# EAGLE design RainbowCycle (EAGLE 6.5.0)
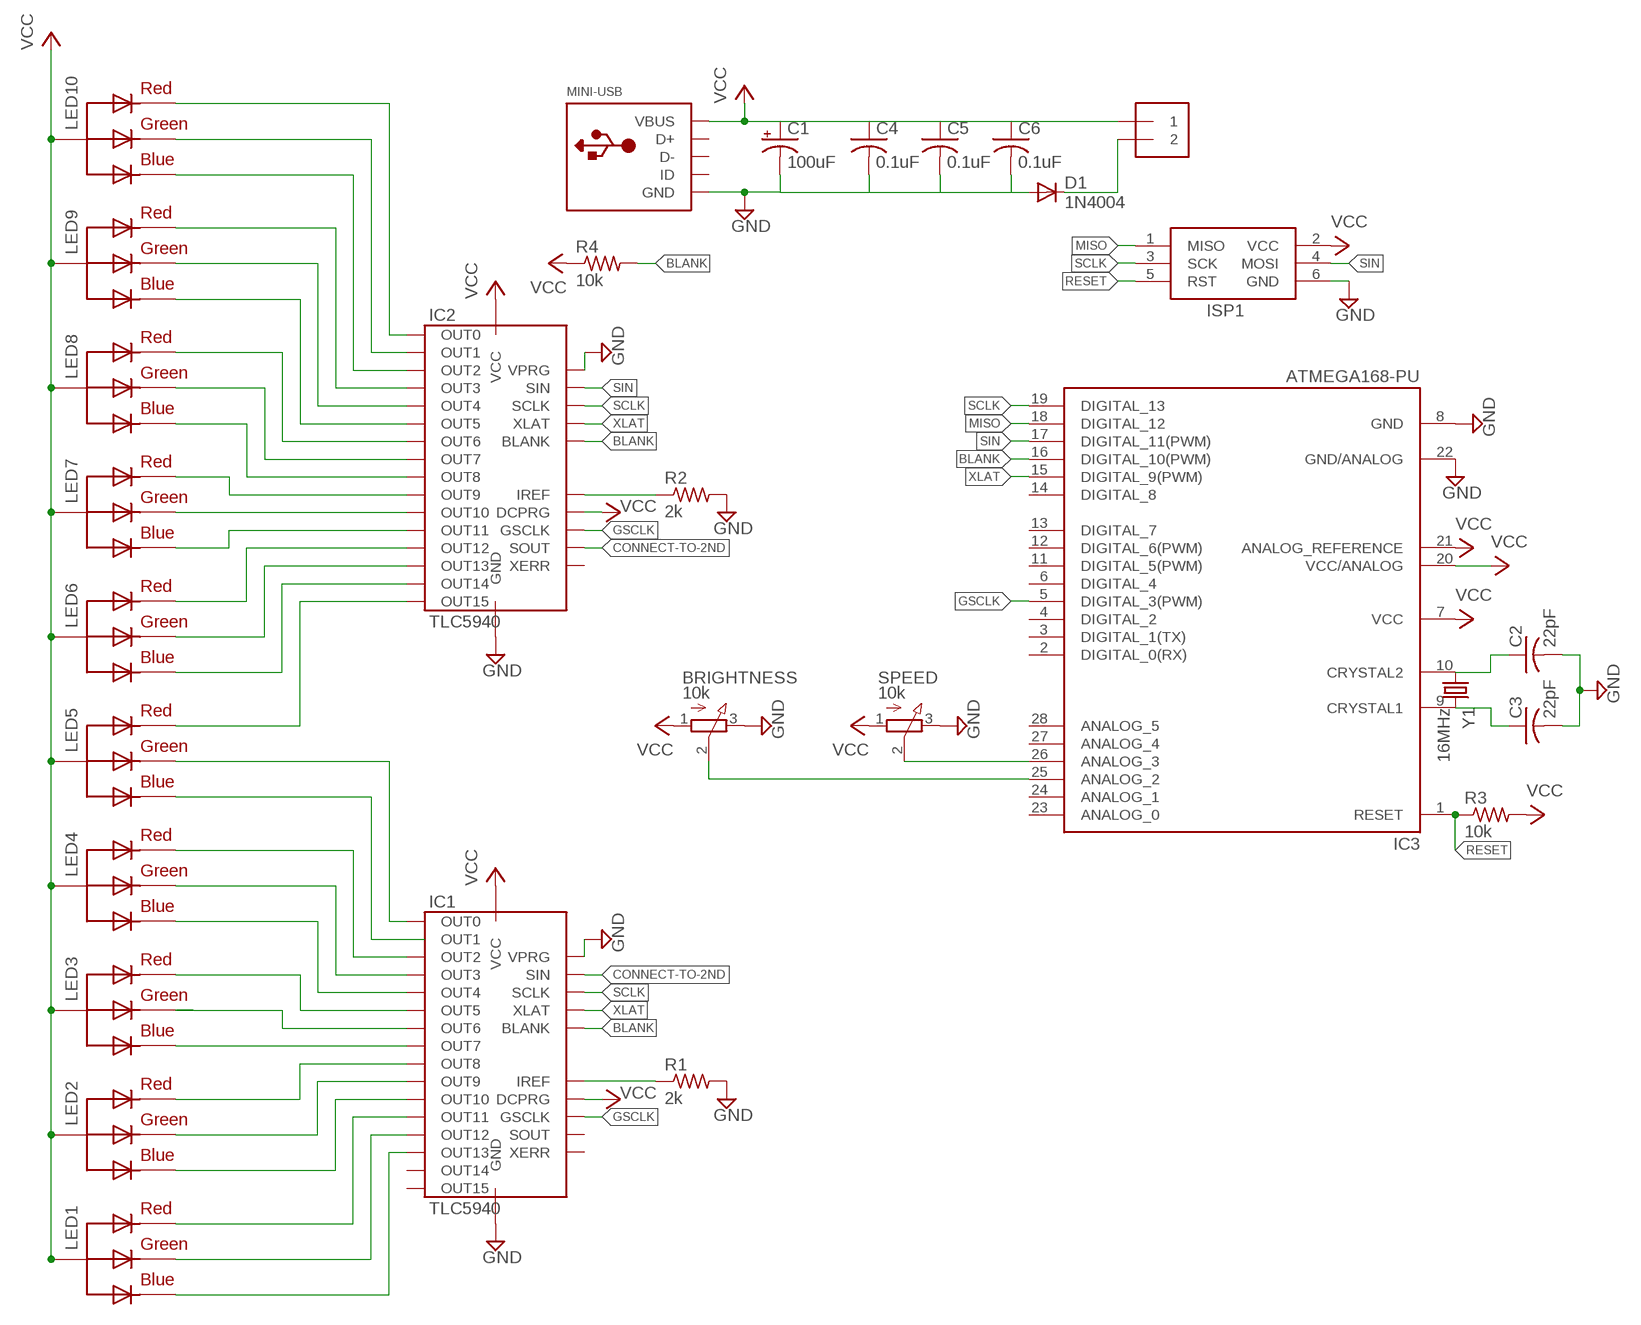
[diagram p0: schematic, sheet 1]

## Parts
BLOCK-TERMINAL  1X2-5.08MM  [1X2-5.08MM]
BRIGHTNESS  10k  3RP/1610N  [3RP/1610N]
C1  100uF  CPOL-USE2.5-6  [E2,5-6]
C2  22pF  C-US050-025X075  [C050-025X075]
C3  22pF  C-US050-025X075  [C050-025X075]
C4  0.1uF  C-US050-025X075  [C050-025X075]
C5  0.1uF  C-US050-025X075  [C050-025X075]
C6  0.1uF  C-US050-025X075  [C050-025X075]
D1  1N4004  [DO41-10]
IC1  TLC5940  IC-PACKAGE_DIL28-3  [IC-PACKAGE_DIL28-3]
IC2  TLC5940  IC-PACKAGE_DIL28-3  [IC-PACKAGE_DIL28-3]
IC3  ATMEGA168-PU  [DIL28-3]
ISP1  AVRISP-6  [AVRISP]
LED1  RGBLED_CA  RGBLED_CA-PIRANHA  [PIRANHA5MM]
LED2  RGBLED_CA  RGBLED_CA-PIRANHA  [PIRANHA5MM]
LED3  RGBLED_CA  RGBLED_CA-PIRANHA  [PIRANHA5MM]
LED4  RGBLED_CA  RGBLED_CA-PIRANHA  [PIRANHA5MM]
LED5  RGBLED_CA  RGBLED_CA-PIRANHA  [PIRANHA5MM]
LED6  RGBLED_CA  RGBLED_CA-PIRANHA  [PIRANHA5MM]
LED7  RGBLED_CA  RGBLED_CA-PIRANHA  [PIRANHA5MM]
LED8  RGBLED_CA  RGBLED_CA-PIRANHA  [PIRANHA5MM]
LED9  RGBLED_CA  RGBLED_CA-PIRANHA  [PIRANHA5MM]
LED10  RGBLED_CA  RGBLED_CA-PIRANHA  [PIRANHA5MM]
MINI-USB  USBMOLEX  [USB-MINIB-THM-MOLEX]
R1  2k  R-US_0207/10  [0207/10]
R2  2k  R-US_0207/10  [0207/10]
R3  10k  R-US_0207/10  [0207/10]
R4  10k  R-US_0207/10  [0207/10]
SPEED  10k  3RP/1610N  [3RP/1610N]
Y1  16MHz  CRYSTALHC49US  [HC49US]

## Nets
BLANK: IC1.23(BLANK) IC2.23(BLANK) IC3.16(DIGITAL_10(PWM)) R4.2
CONNECT-TO-2ND: IC1.26(SIN) IC2.17(SOUT)
GND [gnd]: BRIGHTNESS.3(E) C1.- C2.2 C3.2 C4.2 C5.2 C6.2 D1.A IC1.22(GND) IC1.27(VPRG) IC2.22(GND) IC2.27(VPRG) IC3.8(GND) IC3.22(GND/ANALOG) ISP1.6(GND) MINI-USB.GND MINI-USB.GND1(GND) MINI-USB.GND4(GND) R1.2 R2.2 SPEED.3(E)
GSCLK: IC1.18(GSCLK) IC2.18(GSCLK) IC3.5(DIGITAL_3(PWM))
MISO: IC3.18(DIGITAL_12) ISP1.1(MISO)
N$1: BRIGHTNESS.2(S) IC3.25(ANALOG_2)
N$2: IC3.26(ANALOG_3) SPEED.2(S)
N$6: IC2.20(IREF) R2.1
N$12: BLOCK-TERMINAL.2 D1.C
N$16: C3.1 IC3.9(CRYSTAL1) Y1.2
N$21: C2.1 IC3.10(CRYSTAL2) Y1.1
N$22: IC2.28(OUT0) LED10.3(RED)
N$23: IC1.1(OUT1) LED5.1(BLUE)
N$24: IC2.1(OUT1) LED10.2(GREEN)
N$25: IC2.2(OUT2) LED10.1(BLUE)
N$26: IC1.20(IREF) R1.1
N$27: IC2.3(OUT3) LED9.3(RED)
N$28: IC2.4(OUT4) LED9.2(GREEN)
N$29: IC2.5(OUT5) LED9.1(BLUE)
N$30: IC2.6(OUT6) LED8.3(RED)
N$33: IC2.7(OUT7) LED8.2(GREEN)
N$34: IC2.8(OUT8) LED8.1(BLUE)
N$35: IC2.9(OUT9) LED7.3(RED)
N$36: IC2.10(OUT10) LED7.2(GREEN)
N$37: IC2.11(OUT11) LED7.1(BLUE)
N$38: IC2.12(OUT12) LED6.3(RED)
N$39: IC2.13(OUT13) LED6.2(GREEN)
N$40: IC2.14(OUT14) LED6.1(BLUE)
N$41: IC2.15(OUT15) LED5.3(RED)
N$42: IC1.28(OUT0) LED5.2(GREEN)
N$43: IC1.13(OUT13) LED1.1(BLUE)
N$44: IC1.2(OUT2) LED4.3(RED)
N$45: IC1.3(OUT3) LED4.2(GREEN)
N$46: IC1.4(OUT4) LED4.1(BLUE)
N$47: IC1.5(OUT5) LED3.3(RED)
N$48: IC1.6(OUT6) LED3.2(GREEN)
N$49: IC1.7(OUT7) LED3.1(BLUE)
N$50: IC1.12(OUT12) LED1.2(GREEN)
N$51: IC1.11(OUT11) LED1.3(RED)
N$52: IC1.10(OUT10) LED2.1(BLUE)
N$53: IC1.9(OUT9) LED2.2(GREEN)
N$54: IC1.8(OUT8) LED2.3(RED)
RESET: IC3.1(RESET) ISP1.5(RST) R3.1
SCLK: IC1.25(SCLK) IC2.25(SCLK) IC3.19(DIGITAL_13) ISP1.3(SCK)
SIN: IC2.26(SIN) IC3.17(DIGITAL_11(PWM)) ISP1.4(MOSI)
VCC [power]: BLOCK-TERMINAL.1 BRIGHTNESS.1(A) C1.+ C4.1 C5.1 C6.1 IC1.19(DCPRG) IC1.21(VCC) IC2.19(DCPRG) IC2.21(VCC) IC3.7(VCC) IC3.20(VCC/ANALOG) IC3.21(ANALOG_REFERENCE) ISP1.2(VCC) LED1.4(VCC) LED2.4(VCC) LED3.4(VCC) LED4.4(VCC) LED5.4(VCC) LED6.4(VCC) LED7.4(VCC) LED8.4(VCC) LED9.4(VCC) LED10.4(VCC) MINI-USB.VBUS R3.2 R4.1 SPEED.1(A)
XLAT: IC1.24(XLAT) IC2.24(XLAT) IC3.15(DIGITAL_9(PWM))
Unconnected: IC1.14(OUT14) IC1.15(OUT15) IC1.16(XERR) IC1.17(SOUT) IC2.16(XERR) IC3.2(DIGITAL_0(RX)) IC3.3(DIGITAL_1(TX)) IC3.4(DIGITAL_2) IC3.6(DIGITAL_4) IC3.11(DIGITAL_5(PWM)) IC3.12(DIGITAL_6(PWM)) IC3.13(DIGITAL_7) IC3.14(DIGITAL_8) IC3.23(ANALOG_0) IC3.24(ANALOG_1) IC3.27(ANALOG_4) IC3.28(ANALOG_5) MINI-USB.D+ MINI-USB.D- MINI-USB.ID

## Library data of the parts
BLOCK-TERMINAL = adafruit:1X2: 3.5mm Terminal block http://www.ladyada.net/library/pcb/eaglelibrary.html
BRIGHTNESS SPEED = pot:3RP/1610N: 16mm Potentiometer one level Source: http://www.alphapotentiometers.net/html/16mm_pot_2.html
C1 = rcl:CPOL-US: POLARIZED CAPACITOR, American symbol
C2-C6 = adafruit:C-US: CAPACITOR, American symbol
D1 = adafruit:1N4004: DIODE General purpose 1N400x type rectifier (With bigger pads) http://www.ladyada.net/library/pcb/eaglelibrary.html
IC1 IC2 = TLC5940:IC-PACKAGE_DIL28: Dual In Line
IC3 = Arduino-AVR:ATMEGA168-PU
ISP1 = adafruit:AVRISP: AVR ISP HEADER Standard 6 pin header for AVR programming
LED1-LED10 = adafruit:RGBLED_CA: RGB LED, common-anode 5MM Staggered pins 5mm Piranha package http://www.ladyada.net/library/pcb/eaglelibrary.html
MINI-USB = adafruit:USB: USB Connectors USBMINIB - Surface Mount Female Mini-B USB Connector 4UConnector: 06564 By microbuilder.eu Thru-hole RA Female Mini-B USB Connector 4UConnector: 18732 By ladyada.net
R1-R4 = rcl:R-US_: RESISTOR, American symbol
Y1 = SparkFun-FreqCtrl:CRYSTAL: Various standard crystals. Proven footprints. Spark Fun Electronics SKU : COM-00534

## Net classes
0 default: width 0.254 mm, drill 0.508 mm, clearance 0.305 mm
1 power: width 0.61 mm, drill 0.61 mm, clearance 0.305 mm
2 gnd: width 0.305 mm, drill 0.559 mm, clearance 0.305 mm

## Board
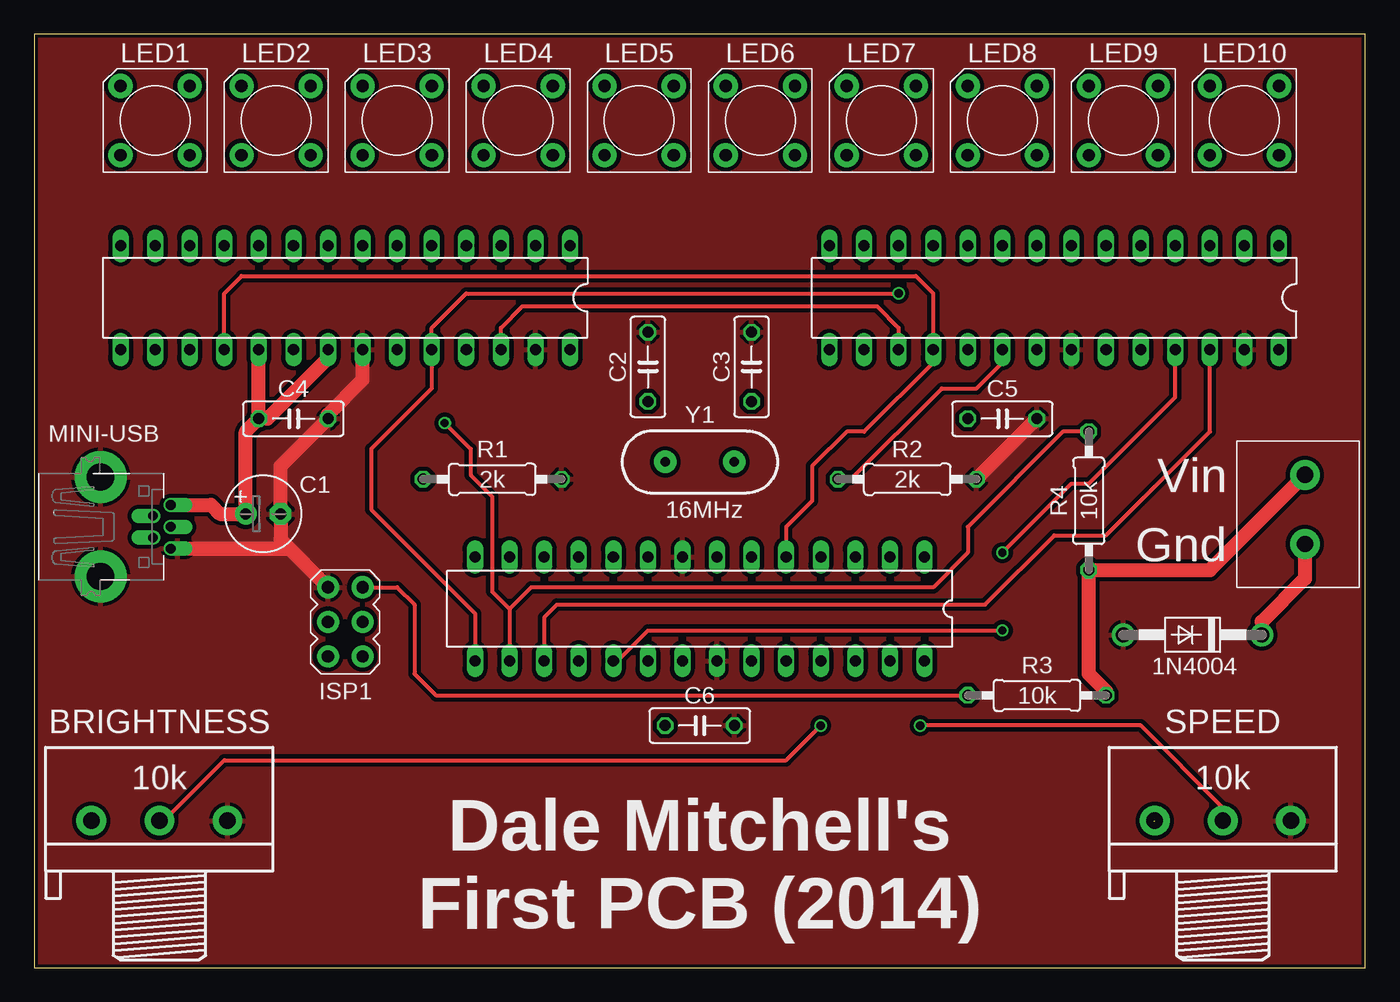
[diagram p1: board, top side]
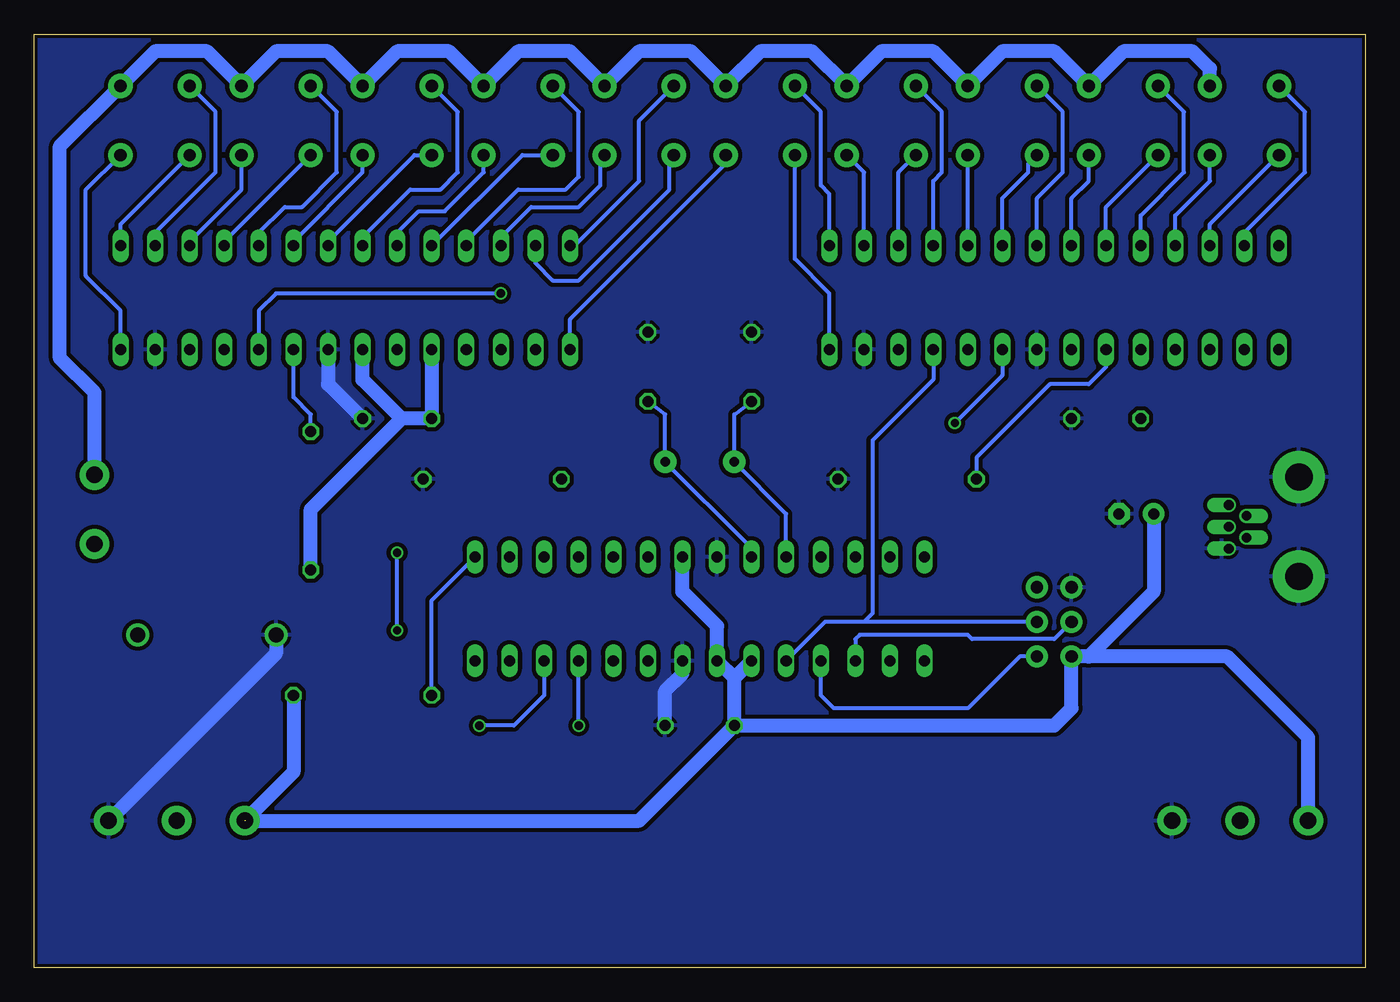
[diagram p2: board, bottom side, seen from below]

Size 97.79 x 68.58 mm. Coordinates in mm from the lower left corner, seen from the top.
Outline: 0,68.58 0,0 97.79,0 97.79,68.58 0,68.58
Copper layers (1*2*15*16): Top 0.035mm / dielectric 0.2mm / Route2 0.0175mm / dielectric 1.1mm / Route15 0.0175mm / dielectric 0.2mm / Bottom 0.035mm
Design rules "SeeedStudio_DRU_no_angle_20130527": minimum track width 6mil, minimum drill 12mil, track to track 6mil, track to pad 6mil, pad to pad 6mil, via to via 6mil, smd to smd 0mil, copper to edge 10mil, drill to drill 10mil, minimum pad ring 6mil, minimum via ring 6mil, stop-mask expansion 2mil, vias tented up to drill 25mil, thermal gap 10mil

### Footprints (pad centres in the part's own frame; a part is rotated, then mirrored left to right if it is on the bottom)
1X2-5.08MM = drill 1.2 pad 2.184: 1 2.54,0; 2 -2.54,0
3RP/1610N = drill 1.2 pad 2.184: 1 -5,0; 2 0,0; 3 5,0
E2,5-6 = drill 0.813 pad 1.6: + -1.27,0 | drill 0.813 pad 1.6 octagon: - 1.27,0
C050-025X075 = drill 0.813 octagon: 1 -2.54,0; 2 2.54,0
DO41-10 = drill 1.118: A 5.08,0; C -5.08,0
IC-PACKAGE_DIL28-3 = drill 0.813 long: 1 -16.51,-3.81; 2 -13.97,-3.81; 3 -11.43,-3.81; 4 -8.89,-3.81; 5 -6.35,-3.81; 6 -3.81,-3.81; 7 -1.27,-3.81; 8 1.27,-3.81; 9 3.81,-3.81; 10 6.35,-3.81; 11 8.89,-3.81; 12 11.43,-3.81; 13 13.97,-3.81; 14 16.51,-3.81; 15 16.51,3.81; 16 13.97,3.81; 17 11.43,3.81; 18 8.89,3.81; 19 6.35,3.81; 20 3.81,3.81; 21 1.27,3.81; 22 -1.27,3.81; 23 -3.81,3.81; 24 -6.35,3.81; 25 -8.89,3.81; 26 -11.43,3.81; 27 -13.97,3.81; 28 -16.51,3.81
DIL28-3 = drill 0.813 long: 1 -16.51,-3.81; 2 -13.97,-3.81; 3 -11.43,-3.81; 4 -8.89,-3.81; 5 -6.35,-3.81; 6 -3.81,-3.81; 7 -1.27,-3.81; 8 1.27,-3.81; 9 3.81,-3.81; 10 6.35,-3.81; 11 8.89,-3.81; 12 11.43,-3.81; 13 13.97,-3.81; 14 16.51,-3.81; 15 16.51,3.81; 16 13.97,3.81; 17 11.43,3.81; 18 8.89,3.81; 19 6.35,3.81; 20 3.81,3.81; 21 1.27,3.81; 22 -1.27,3.81; 23 -3.81,3.81; 24 -6.35,3.81; 25 -8.89,3.81; 26 -11.43,3.81; 27 -13.97,3.81; 28 -16.51,3.81
AVRISP = drill 0.9 pad 1.626: 1 -1.27,2.54; 2 1.27,2.54; 3 -1.27,0; 4 1.27,0; 5 -1.27,-2.54; 6 1.27,-2.54
PIRANHA5MM = drill 0.9 pad 1.778: 1 -2.54,2.54; 2 -2.54,-2.54; 3 2.54,-2.54; 4 2.54,2.54
USB-MINIB-THM-MOLEX = drill 0.7 offset: D+ 0,9.72; D- -0.8,8.42; GND 1.6,9.72; ID 0.8,8.42; VBUS -1.6,9.72 | drill 2 pad 3.81: GND1 -3.65,4.57; GND4 3.65,4.57
0207/10 = drill 0.813 octagon: 1 -5.08,0; 2 5.08,0
HC49US = drill 0.7 pad 1.651: 1 -2.54,0; 2 2.54,0

### Placement (x,y rotation side)
BLOCK-TERMINAL  93.34,33.66 90 top
BRIGHTNESS  9.21,10.8 0 top
C1  16.83,33.34 0 top
C2  45.08,44.13 90 top
C3  52.7,44.13 90 top
C4  19.05,40.32 0 top
C5  71.12,40.32 0 top
C6  48.89,17.78 0 top
D1  85.09,24.45 180 top
IC1  22.86,49.21 180 top
IC2  74.93,49.21 180 top
IC3  48.89,26.35 180 top
ISP1  22.86,25.4 180 top
LED1  8.89,62.23 0 top
LED2  17.78,62.23 0 top
LED3  26.67,62.23 0 top
LED4  35.56,62.23 0 top
LED5  44.45,62.23 0 top
LED6  53.34,62.23 0 top
LED7  62.23,62.23 0 top
LED8  71.12,62.23 0 top
LED9  80.01,62.23 0 top
LED10  88.9,62.23 0 top
MINI-USB  0.32,32.38 270 top
R1  33.66,35.88 0 top
R2  64.13,35.88 0 top
R3  73.66,20 0 top
R4  77.47,34.29 90 top
SPEED  87.31,10.8 0 top
Y1  48.89,37.15 0 top

### Tracks (layer width: path | path; a pad name or v marks a point on that pad's centre or on a via)
BLANK  (via drill 0.6)
  Top 0.305: 34.92,26.35 33.66,27.62 33.66,34.61 32.07,36.2 32.07,38.1 v30.16,40.01 | 34.92,26.35 IC3.16 | R4.2 75.56,39.37 68.58,32.38 68.58,30.48 66.04,27.94 36.51,27.94 34.92,26.35
  Bottom 0.305: R4.2 77.47,40.64 78.74,41.91 IC2.23 | IC1.23 26.67,43.5 v30.16,40.01
CONNECT-TO-2ND
  Top 0.305: IC1.26 34.29,46.99 35.88,48.58 61.91,48.58 63.5,46.99 IC2.17
GND
  Top 1.016: IC1.22 24.13,43.18 21.59,40.64 C4.2 18.1,36.83 C1.- 18.1,31.43 ISP1.6 18.75,30.79 MINI-USB.GND | R2.2 C5.2
  Bottom 1.016: D1.A 80.01,23.1 SPEED.3 | C6.2 51.44,20.32 50.16,21.59 IC3.22 | IC2.22 76.2,42.86 C5.2
  pour Top: -1.27,69.85 99.06,69.85 99.06,-1.27 -1.27,-1.27
  pour Bottom: -1.27,69.85 99.06,69.85 99.06,-1.27 -1.27,-1.27
GSCLK
  Top 0.305: IC3.5 55.24,32.38 57.15,34.29 57.15,36.83 59.69,39.37 60.96,39.37 66.04,44.45 IC2.18 66.04,49.53 64.77,50.8 15.24,50.8 13.97,49.53 IC1.18
MISO
  Bottom 0.305: ISP1.1 25.4,22.86 29.21,19.05 39.05,19.05 40,20 IC3.18
N$1  (via drill 0.6)
  Top 0.305: v57.78,17.78 55.24,15.24 13.97,15.24 9.52,10.8 BRIGHTNESS.2
  Bottom 0.305: v57.78,17.78 IC3.25
N$2  (via drill 0.6)
  Top 0.305: SPEED.2 87.31,11.75 81.28,17.78 v65.09,17.78
  Bottom 0.305: IC3.26 60.33,20 62.55,17.78 v65.09,17.78
N$6
  Top 0.305: R2.1 60.01,35.88 66.67,42.55 69.22,42.55 71.12,44.45 IC2.20
N$12
  Top 1.016: BLOCK-TERMINAL.2 93.34,28.57 90.17,25.4 D1.C
N$16
  Bottom 0.305: IC3.9 45.08,31.12 45.4,31.12 Y1.2 51.44,40.64 C3.1
N$21
  Bottom 0.305: C2.1 46.35,40.64 Y1.1 42.55,33.34 IC3.10
N$22
  Bottom 0.305: IC2.28 91.44,48.26 93.98,50.8 93.98,57.15 LED10.3
N$23
  Bottom 0.305: LED5.1 40,62.87 40,57.47 39.37,56.83 IC1.1
N$24
  Bottom 0.305: IC2.1 91.44,54.61 LED10.2
N$25
  Bottom 0.305: IC2.2 88.9,53.98 84.45,58.42 84.45,62.87 LED10.1
N$26
  Bottom 0.305: IC1.20 19.05,44.13 20.32,42.86 23.18,42.86 28.57,37.47 R1.1
N$27
  Bottom 0.305: IC2.3 86.36,53.34 82.55,57.15 LED9.3
N$28
  Bottom 0.305: IC2.4 83.82,53.34 LED9.2
N$29
  Bottom 0.305: IC2.5 81.28,53.98 79.38,55.88 78.1,55.88 75.56,58.42 75.56,62.87 LED9.1
N$30
  Bottom 0.305: IC2.6 78.74,53.34 73.66,58.42 LED8.3
N$33
  Bottom 0.305: IC2.7 76.2,53.34 69.85,59.69 LED8.2
N$34
  Bottom 0.305: IC2.8 73.66,53.66 70.17,57.15 67.94,57.15 66.67,58.42 66.67,62.87 LED8.1
N$35
  Bottom 0.305: IC2.9 71.12,53.98 69.53,55.56 67.63,55.56 64.77,58.42 LED7.3
N$36
  Bottom 0.305: IC2.10 61.91,59.69 LED7.2
N$37
  Bottom 0.305: IC2.11 66.04,53.34 62.23,57.15 58.74,57.15 57.78,58.1 57.78,62.87 LED7.1
N$38
  Bottom 0.305: IC2.12 63.5,53.66 61.28,55.88 57.78,55.88 56.2,57.47 56.2,59.37 LED6.3
N$39
  Bottom 0.305: IC2.13 60.96,51.75 59.69,50.48 57.78,50.48 51.12,57.15 51.12,59.37 LED6.2
N$40
  Bottom 0.305: IC2.14 58.1,53.02 53.34,57.79 53.34,62.23 LED6.1
N$41
  Bottom 0.305: IC2.15 58.42,47.62 46.99,59.05 LED5.3
N$42
  Bottom 0.305: IC1.28 39.37,49.53 41.91,52.07 LED5.2
N$43
  Bottom 0.305: IC1.13 8.89,53.98 4.45,58.42 4.45,62.87 LED1.1
N$44
  Bottom 0.305: IC1.2 36.83,58.42 LED4.3
N$45
  Bottom 0.305: IC1.3 34.29,58.42 LED4.2
N$46
  Bottom 0.305: IC1.4 31.75,57.79 31.11,58.42 31.11,62.87 LED4.1
N$47
  Bottom 0.305: IC1.5 LED3.3
N$48
  Bottom 0.305: IC1.6 26.67,56.52 24.76,58.42 24.76,59.05 LED3.2
N$49
  Bottom 0.305: IC1.7 24.13,56.52 22.22,58.42 22.22,62.87 LED3.1
N$50
  Bottom 0.305: IC1.12 11.43,54.61 LED1.2
N$51
  Bottom 0.305: IC1.11 13.97,55.24 11.43,57.79 LED1.3
N$52
  Bottom 0.305: IC1.10 16.51,55.24 13.33,58.42 13.33,62.87 LED2.1
N$53
  Bottom 0.305: IC1.9 19.05,55.88 LED2.2
N$54
  Bottom 0.305: IC1.8 21.59,56.52 20.32,57.79 LED2.3
RESET
  Top 0.305: ISP1.5 26.67,27.94 27.94,26.67 27.94,21.59 29.53,20 R3.1
  Bottom 0.305: R3.1 68.58,26.99 IC3.1
SCLK  (via drill 0.6)
  Top 0.305: IC3.19 42.86,22.54 45.08,24.77 v71.12,24.77 | v71.12,30.48 76.2,35.56 77.47,35.56 83.82,41.91 IC2.25
  Bottom 0.305: ISP1.3 36.83,25.4 | 36.83,25.4 39.69,25.4 IC3.19 | IC1.25 31.75,43.18 36.19,38.73 36.19,26.04 36.83,25.4 | v71.12,24.77 v71.12,30.48
SIN
  Top 0.305: IC2.26 86.36,39.37 78.74,31.75 74.93,31.75 69.85,26.67 38.42,26.67 37.47,25.72 IC3.17
  Bottom 0.305: IC3.17 37.47,24.13 37.15,24.45 35.56,24.45 29.21,24.45 28.89,24.13 22.86,24.13 ISP1.4
VCC  (1 unrouted)
  Top 1.016: R3.2 78.74,20.32 77.47,21.59 R4.1 86.36,29.21 BLOCK-TERMINAL.1 | MINI-USB.VBUS 13,33.98 13.65,33.34 C1.+ 15.56,39.37 C4.1 | C4.1 IC1.19 | IC1.21 21.59,44.77 17.14,40.32 C4.1
  Bottom 1.016: LED1.4 11.43,66.04 12.7,67.31 17.78,67.31 LED2.4 22.86,67.31 26.67,67.31 LED3.4 31.75,67.31 35.56,67.31 LED4.4 40.64,67.31 44.45,67.31 LED5.4 49.53,67.31 53.34,67.31 LED6.4 58.42,67.31 62.23,67.31 LED7.4 67.31,67.31 71.12,67.31 LED8.4 76.2,67.31 80.01,67.31 LED9.4 85.09,67.31 88.9,67.31 LED10.4 95.88,60.33 95.88,44.77 93.34,42.23 BLOCK-TERMINAL.1 | R3.2 78.74,14.37 SPEED.1 | C1.+ 15.56,27.62 20.32,22.86 ISP1.2 | BRIGHTNESS.1 4.21,16.91 10.16,22.86 ISP1.2 | C6.1 22.86,17.78 21.59,19.05 ISP1.2 | C6.1 46.35,21.27 | 46.35,21.27 IC3.20 | 46.35,21.27 IC3.21 47.62,25.08 50.16,27.62 IC3.7 | 70.8,40.32 C5.1 IC2.19 | 70.8,40.32 73.66,43.18 IC2.21 | R4.1 77.47,33.66 70.8,40.32 | 82.23,10.8 53.34,10.8 C6.1
XLAT  (via drill 0.6)
  Top 0.305: IC3.15 32.39,26.04 24.76,33.66 24.76,38.1 29.21,42.55 IC1.24 29.21,46.99 31.75,49.53 v63.5,49.53
  Bottom 0.305: v63.5,49.53 80.01,49.53 81.28,48.26 IC2.24

### Text on the board
_tsilk: Dale Mitchell's / First PCB (2014)